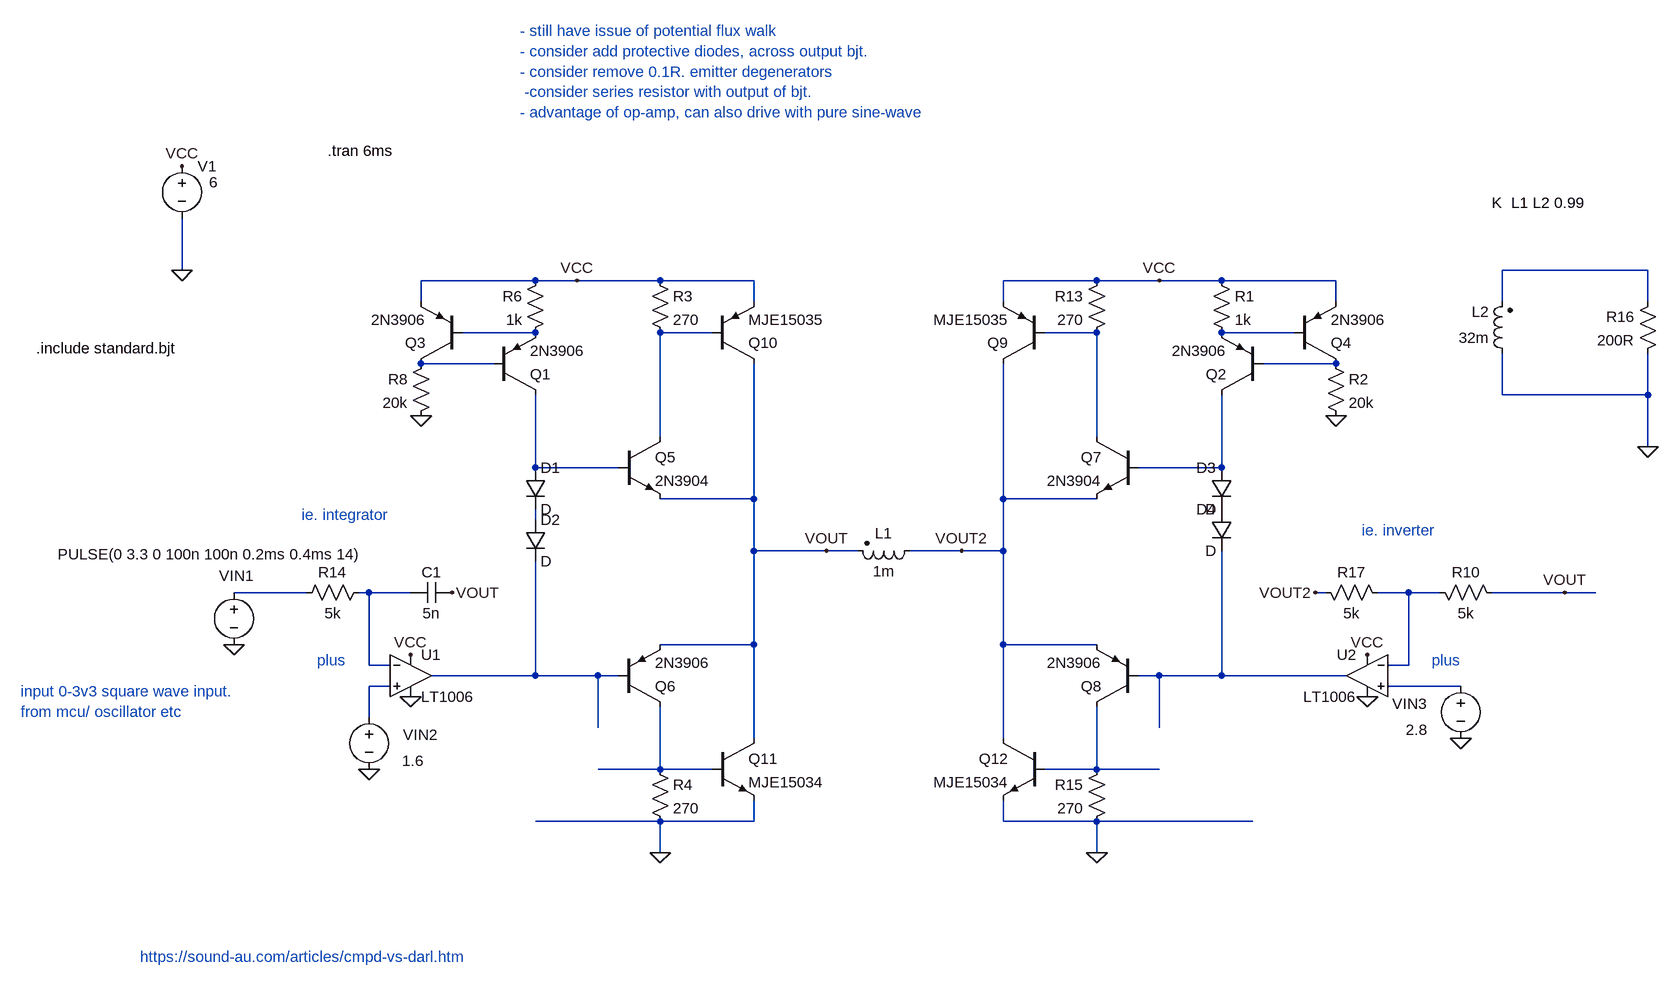
[diagram p0: schematic Draft47.asc]
Draft47.asc, the LTspice schematic file:
Version 4
SHEET 1 3300 1956
WIRE 464 -208 464 -288
WIRE 2720 -208 2496 -208
WIRE 1008 -192 832 -192
WIRE 1072 -192 1008 -192
WIRE 1200 -192 1072 -192
WIRE 1344 -192 1200 -192
WIRE 1872 -192 1728 -192
WIRE 1968 -192 1872 -192
WIRE 2064 -192 1968 -192
WIRE 2240 -192 2064 -192
WIRE 832 -160 832 -192
WIRE 1344 -160 1344 -192
WIRE 1728 -160 1728 -192
WIRE 2240 -160 2240 -192
WIRE 2496 -160 2496 -208
WIRE 2720 -160 2720 -208
WIRE 1008 -112 896 -112
WIRE 1280 -112 1200 -112
WIRE 1872 -112 1792 -112
WIRE 2176 -112 2064 -112
WIRE 944 -64 832 -64
WIRE 2240 -64 2128 -64
WIRE 2496 -16 2496 -80
WIRE 2720 -16 2720 -80
WIRE 2720 -16 2496 -16
WIRE 1200 48 1200 -112
WIRE 1872 48 1872 -112
WIRE 2720 64 2720 -16
WIRE 1008 96 1008 -16
WIRE 1136 96 1008 96
WIRE 2064 96 2064 -16
WIRE 2064 96 1936 96
WIRE 1344 144 1344 -64
WIRE 1344 144 1200 144
WIRE 1728 144 1728 -64
WIRE 1872 144 1728 144
WIRE 1008 176 1008 160
WIRE 1344 224 1344 144
WIRE 1456 224 1344 224
WIRE 1504 224 1456 224
WIRE 1664 224 1584 224
WIRE 1728 224 1728 144
WIRE 1728 224 1664 224
WIRE 656 288 544 288
WIRE 752 288 736 288
WIRE 816 288 752 288
WIRE 2224 288 2208 288
WIRE 2352 288 2304 288
WIRE 2400 288 2352 288
WIRE 2592 288 2480 288
WIRE 2640 288 2592 288
WIRE 1344 368 1344 224
WIRE 1344 368 1200 368
WIRE 1728 368 1728 224
WIRE 1872 368 1728 368
WIRE 752 400 752 288
WIRE 784 400 752 400
WIRE 2352 400 2352 288
WIRE 2352 400 2320 400
WIRE 1008 416 1008 240
WIRE 1008 416 848 416
WIRE 1104 416 1008 416
WIRE 1136 416 1104 416
WIRE 1968 416 1936 416
WIRE 2064 416 2064 224
WIRE 2064 416 1968 416
WIRE 2256 416 2064 416
WIRE 784 432 752 432
WIRE 2432 432 2320 432
WIRE 752 480 752 432
WIRE 1104 496 1104 416
WIRE 1968 496 1968 416
WIRE 1344 512 1344 368
WIRE 1728 512 1728 368
WIRE 1200 560 1200 464
WIRE 1200 560 1104 560
WIRE 1280 560 1200 560
WIRE 1872 560 1872 464
WIRE 1872 560 1792 560
WIRE 1968 560 1872 560
WIRE 1200 640 1008 640
WIRE 1344 640 1344 608
WIRE 1344 640 1200 640
WIRE 1728 640 1728 608
WIRE 1872 640 1728 640
WIRE 2112 640 1872 640
WIRE 1200 688 1200 640
WIRE 1872 688 1872 640
FLAG 464 -368 VCC
FLAG 1456 224 VOUT
FLAG 544 368 0
FLAG 1072 -192 VCC
FLAG 880 288 VOUT
FLAG 1200 688 0
FLAG 464 -208 0
FLAG 752 560 0
FLAG 816 448 0
FLAG 816 384 VCC
FLAG 832 16 0
FLAG 1664 224 VOUT2
FLAG 1968 -192 VCC
FLAG 1872 688 0
FLAG 2288 448 0
FLAG 2288 384 VCC
FLAG 2240 16 0
FLAG 2208 288 VOUT2
FLAG 2592 288 VOUT
FLAG 2432 512 0
FLAG 2720 64 0
SYMBOL pnp 944 -16 M180
SYMATTR InstName Q1
SYMATTR Value 2N3906
SYMBOL pnp 896 -64 R180
SYMATTR InstName Q3
SYMATTR Value 2N3906
SYMBOL res 1024 -208 M0
SYMATTR InstName R6
SYMATTR Value 1k
SYMBOL voltage 464 -384 R0
WINDOW 123 0 0 Left 0
WINDOW 39 0 0 Left 0
WINDOW 3 42 41 Left 2
SYMATTR Value 6
SYMATTR InstName V1
SYMBOL res 848 -80 M0
SYMATTR InstName R8
SYMATTR Value 20k
SYMBOL npn 1136 48 R0
SYMATTR InstName Q5
SYMATTR Value 2N3904
SYMBOL pnp 1136 464 M180
SYMATTR InstName Q6
SYMATTR Value 2N3906
SYMBOL voltage 544 272 R0
WINDOW 123 0 0 Left 0
WINDOW 39 0 0 Left 0
WINDOW 3 -271 -43 Left 2
WINDOW 0 -23 -10 Left 2
SYMATTR Value PULSE(0 3.3 0 100n 100n 0.2ms 0.4ms 14)
SYMATTR InstName VIN1
SYMBOL res 640 304 R270
WINDOW 0 32 56 VTop 2
WINDOW 3 0 56 VBottom 2
SYMATTR InstName R14
SYMATTR Value 5k
SYMBOL diode 992 96 R0
SYMATTR InstName D1
SYMBOL diode 992 176 R0
SYMATTR InstName D2
SYMBOL cap 880 272 R90
WINDOW 0 0 32 VBottom 2
WINDOW 3 32 32 VTop 2
SYMATTR InstName C1
SYMATTR Value 5n
SYMBOL voltage 752 464 R0
WINDOW 123 0 0 Left 0
WINDOW 39 0 0 Left 0
WINDOW 3 51 83 Left 2
WINDOW 0 52 43 Left 2
SYMATTR Value 1.6
SYMATTR InstName VIN2
SYMBOL res 1184 -208 R0
SYMATTR InstName R3
SYMATTR Value 270
SYMBOL res 1184 544 R0
SYMATTR InstName R4
SYMATTR Value 270
SYMBOL pnp 1280 -64 M180
SYMATTR InstName Q10
SYMATTR Value MJE15035
SYMBOL npn 1280 512 R0
SYMATTR InstName Q11
SYMATTR Value MJE15034
SYMBOL OpAmps\\LT1006 816 352 R0
SYMATTR InstName U1
SYMBOL pnp 2128 -16 R180
SYMATTR InstName Q2
SYMATTR Value 2N3906
SYMBOL pnp 2176 -64 M180
SYMATTR InstName Q4
SYMATTR Value 2N3906
SYMBOL res 2048 -208 R0
SYMATTR InstName R1
SYMATTR Value 1k
SYMBOL res 2224 -80 R0
SYMATTR InstName R2
SYMATTR Value 20k
SYMBOL npn 1936 48 M0
SYMATTR InstName Q7
SYMATTR Value 2N3904
SYMBOL pnp 1936 464 R180
SYMATTR InstName Q8
SYMATTR Value 2N3906
SYMBOL res 2496 304 M270
WINDOW 0 32 56 VTop 2
WINDOW 3 0 56 VBottom 2
SYMATTR InstName R10
SYMATTR Value 5k
SYMBOL diode 2080 96 M0
SYMATTR InstName D3
SYMBOL diode 2080 160 M0
SYMATTR InstName D4
SYMBOL res 1888 -208 M0
SYMATTR InstName R13
SYMATTR Value 270
SYMBOL res 1888 544 M0
SYMATTR InstName R15
SYMATTR Value 270
SYMBOL pnp 1792 -64 R180
SYMATTR InstName Q9
SYMATTR Value MJE15035
SYMBOL npn 1792 512 M0
SYMATTR InstName Q12
SYMATTR Value MJE15034
SYMBOL res 2736 -176 M0
SYMATTR InstName R16
SYMATTR Value 200R
SYMBOL OpAmps\\LT1006 2288 352 M0
SYMATTR InstName U2
SYMBOL res 2320 304 M270
WINDOW 0 32 56 VTop 2
WINDOW 3 0 56 VBottom 2
SYMATTR InstName R17
SYMATTR Value 5k
SYMBOL voltage 2432 416 M0
WINDOW 123 0 0 Left 0
WINDOW 39 0 0 Left 0
WINDOW 3 51 83 Left 2
WINDOW 0 52 43 Left 2
SYMATTR Value 2.8
SYMATTR InstName VIN3
SYMBOL ind2 1600 208 R90
WINDOW 0 4 56 VBottom 2
WINDOW 3 32 56 VTop 2
SYMATTR InstName L1
SYMATTR Value 1m
SYMATTR Type ind
SYMBOL ind2 2512 -64 R180
WINDOW 0 36 80 Left 2
WINDOW 3 36 40 Left 2
SYMATTR InstName L2
SYMATTR Value 32m
SYMATTR Type ind
TEXT 688 -392 Left 2 !.tran 6ms
TEXT 672 392 Left 2 ;plus
TEXT 216 440 Left 2 ;input 0-3v3 square wave input.\nfrom mcu/ oscillator etc
TEXT 240 -88 Left 2 !.include standard.bjt
TEXT 2432 392 Right 2 ;plus
TEXT 984 -576 Left 2 ;- still have issue of potential flux walk\n- consider add protective diodes, across output bjt.\n- consider remove 0.1R. emitter degenerators\n -consider series resistor with output of bjt.\n- advantage of op-amp, can also drive with pure sine-wave
TEXT 2480 -312 Left 2 !K  L1 L2 0.99
TEXT 648 168 Left 2 ;ie. integrator
TEXT 2280 192 Left 2 ;ie. inverter
TEXT 400 848 Left 2 ;https://sound-au.com/articles/cmpd-vs-darl.htm

The netlist it stands for:
* Draft47.asc
Q1 N008 N006 N002 0 2N3906
Q3 N006 N002 VCC 0 2N3906
R6 VCC N002 1k
V1 VCC 0 6
R8 N006 0 20k
Q5 N003 N008 VOUT 0 2N3904
Q6 N018 N014 VOUT 0 2N3906
VIN1 N011 0 PULSE(0 3.3 0 100n 100n 0.2ms 0.4ms 14)
R14 N011 N012 5k
D1 N008 N010 D
D2 N010 N014 D
C1 VOUT N012 5n
VIN2 N016 0 1.6
R3 VCC N003 270
R4 N018 0 270
Q10 VOUT N003 VCC 0 MJE15035
Q11 VOUT N018 0 0 MJE15034
XU1 N016 N012 VCC 0 N014 LT1006  ; pins In+ In- V+ V- OUT
Q2 N009 N007 N005 0 2N3906
Q4 N007 N005 VCC 0 2N3906
R1 VCC N005 1k
R2 N007 0 20k
Q7 N004 N009 VOUT2 0 2N3904
Q8 N019 N015 VOUT2 0 2N3906
R10 VOUT N013 5k
D3 N009 P001 D
D4 P001 N015 D
R13 VCC N004 270
R15 N019 0 270
Q9 VOUT2 N004 VCC 0 MJE15035
Q12 VOUT2 N019 0 0 MJE15034
R16 N001 0 200R
XU2 N017 N013 VCC 0 N015 LT1006  ; pins In+ In- V+ V- OUT
R17 N013 VOUT2 5k
VIN3 N017 0 2.8
L1 VOUT2 VOUT 1m
L2 0 N001 32m
.model D D
.lib standard.dio
.model NPN NPN
.model PNP PNP
.lib standard.bjt
.tran 6ms
* plus
* input 0-3v3 square wave input.
* from mcu/ oscillator etc
.include standard.bjt
* plus
* - still have issue of potential flux walk
* - consider add protective diodes, across output bjt.
* - consider remove 0.1R. emitter degenerators
*  -consider series resistor with output of bjt.
* - advantage of op-amp, can also drive with pure sine-wave
K  L1 L2 0.99
* ie. integrator
* ie. inverter
* https://sound-au.com/articles/cmpd-vs-darl.htm
.lib LTC.lib
.backanno
.end